# Altium project ESP32_Adapter_Board_GPIO_PIN.PrjPcb
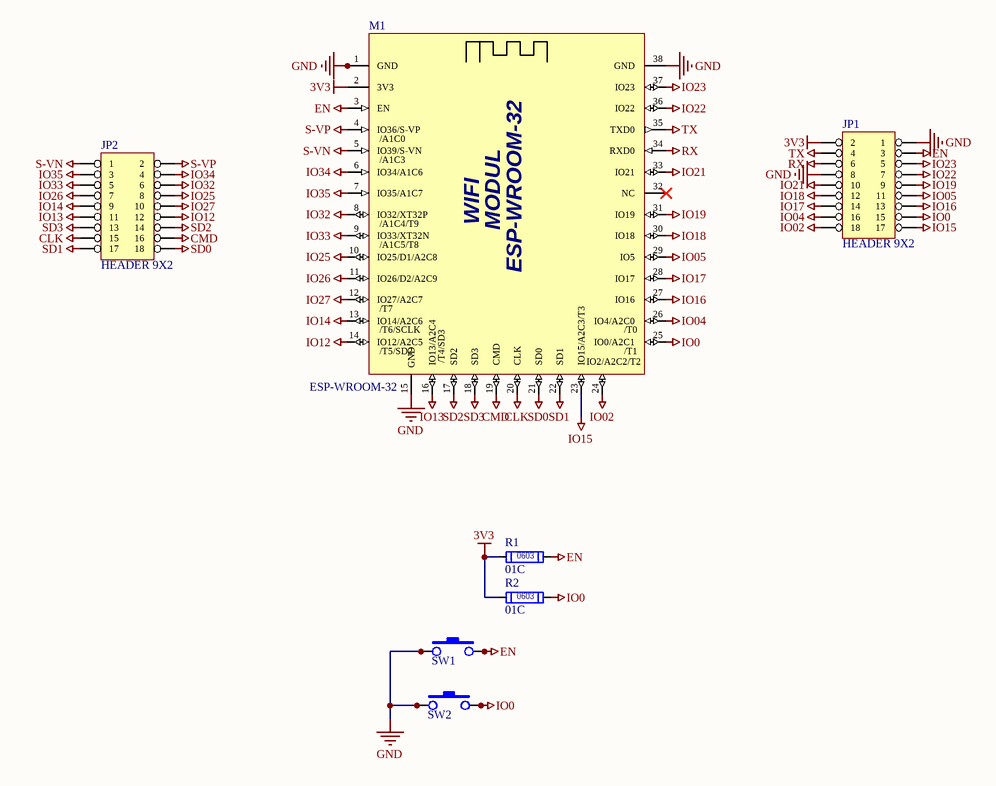
[diagram p0: ESP_Adapter_Board_GPIO_PIN.SchDoc]
1 sheet, 7 parts. Net scope: global (net labels, ports and power ports of the same name join across sheets).
Board file: ESP_Adapter_Board_GPIO_PIN.PcbDoc

## Sheet ESP_Adapter_Board_GPIO_PIN.SchDoc
size A4; SheetNumber: 1; SheetTotal: 1

### Parts
JP1  HEADER 9X2  [H 9x2]
JP2  HEADER 9X2  [H 9x2]
M1  ESP-WROOM-32  [WIFI MODUL ESP-WROOM-32]
R1  01C  [CRES1608-0603 3D]
R2  01C  [CRES1608-0603 3D]
SW1  REG  [SMD TAC SW 6x6x4.3mm]  (value not drawn)
SW2  REG  [SMD TAC SW 6x6x4.3mm]  (value not drawn)

### Nets
3V3: JP1.2 M1.2(3V3) R1.1 R2.1
CLK: JP2.15 M1.20(CLK)
CMD: JP2.16 M1.19(CMD)
EN: JP1.3 M1.3(EN) R1.2 SW1.3 SW1.4
GND: JP1.1 JP1.8 M1.0(GND) M1.1(GND) M1.15(GND) M1.38(GND) SW1.1 SW1.2 SW2.1 SW2.2
IO0: JP1.15 M1.25(IO0/A2C1) R2.2 SW2.3 SW2.4
IO02: JP1.18 M1.24(IO2/A2C2/T2)
IO04: JP1.16 M1.26(IO4/A2C0)
IO05: JP1.11 M1.29(IO5)
IO12: JP2.12 M1.14(IO12/A2C5)
IO13: JP2.11 M1.16(IO13/A2C4)
IO14: JP2.9 M1.13(IO14/A2C6)
IO15: JP1.17 M1.23(IO15/A2C3/T3)
IO16: JP1.13 M1.27(IO16)
IO17: JP1.14 M1.28(IO17)
IO18: JP1.12 M1.30(IO18)
IO19: JP1.9 M1.31(IO19)
IO21: JP1.10 M1.33(IO21)
IO22: JP1.7 M1.36(IO22)
IO23: JP1.5 M1.37(IO23)
IO25: JP2.8 M1.10(IO25/D1/A2C8)
IO26: JP2.7 M1.11(IO26/D2/A2C9)
IO27: JP2.10 M1.12(IO27/A2C7)
IO32: JP2.6 M1.8(IO32/XT32P)
IO33: JP2.5 M1.9(IO33/XT32N)
IO34: JP2.4 M1.6(IO34/A1C6)
IO35: JP2.3 M1.7(IO35/A1C7)
RX: JP1.6 M1.34(RXD0)
S-VN: JP2.1 M1.5(IO39/S-VN)
S-VP: JP2.2 M1.4(IO36/S-VP)
SD0: JP2.18 M1.21(SD0)
SD1: JP2.17 M1.22(SD1)
SD2: JP2.14 M1.17(SD2)
SD3: JP2.13 M1.18(SD3)
TX: JP1.4 M1.35(TXD0)

Not connected (* = marked no-connect by the designer): M1 32(NC)*

### Notes on the sheet
- (in symbol RES_SMD0603 0.100W) 0603
- (in symbol WIFI MODUL ESP-WROOM-32) /A1C0; /A1C3; WIFI; /A1C4/T9; MODUL; /A1C5/T8; /T7; /T6/SCLK; /T0; /T5/SD2; /T1; /T4/SD3

### Library data of the parts
M1 = WIFI MODUL ESP-WROOM-32
R1 R2 = RES_SMD0603 0.100W
SW1 SW2 = SW PB - TAC2: 4 PIN